# Altium schematic sheet IMU Gesture Recognition Sensors.SchDoc
size A4; SheetNumber: 11; SheetTotal: 17
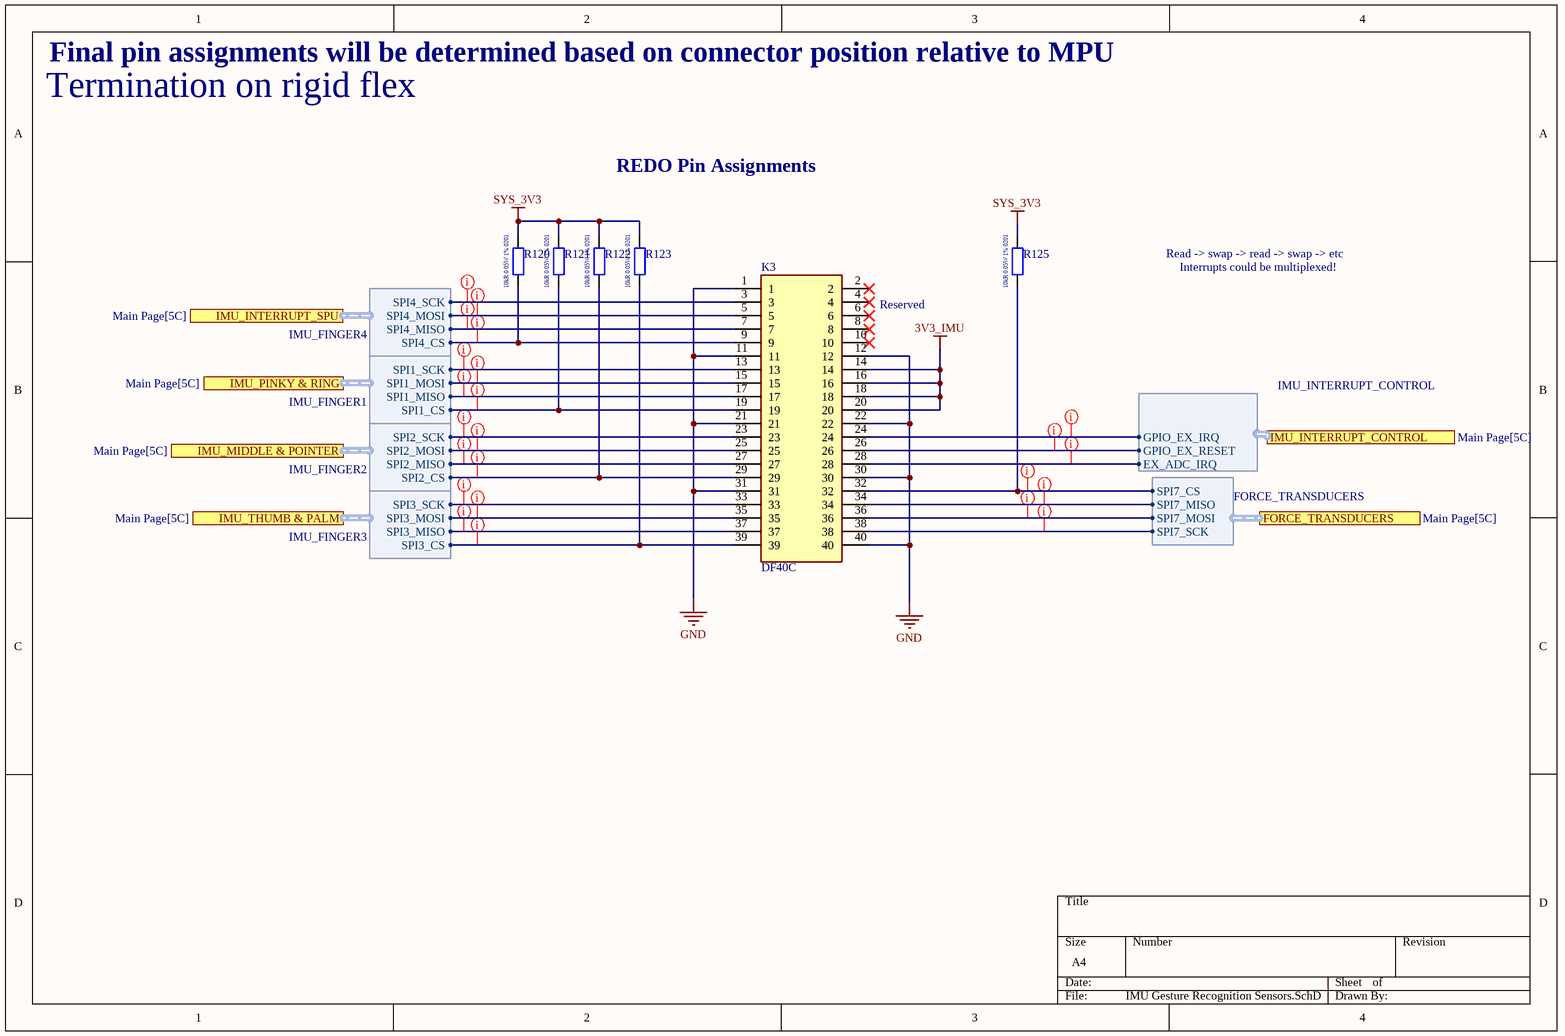
[diagram p0: IMU Gesture Recognition Sensors.SchDoc]

## Parts
K3  DF40C  [HIROSE_DF40C-40DS-0.4V(51)]
R120  ERJ-1GNF1002C  [RESC0603X03L]  (value not drawn)
R121  ERJ-1GNF1002C  [RESC0603X03L]  (value not drawn)
R122  ERJ-1GNF1002C  [RESC0603X03L]  (value not drawn)
R123  ERJ-1GNF1002C  [RESC0603X03L]  (value not drawn)
R125  ERJ-1GNF1002C  [RESC0603X03L]  (value not drawn)

## Ports
FORCE_TRANSDUCERS (harness FORCE_TRANSDUCERS, see Main Page[5C]), IMU_INTERRUPT_CONTROL (harness IMU_INTERRUPT_CONTROL, see Main Page[5C]), IMU_INTERRUPT_SPU (harness IMU_FINGER4, see Main Page[5C]), IMU_MIDDLE & POINTER (harness IMU_FINGER2, see Main Page[5C]), IMU_PINKY & RING (harness IMU_FINGER1, see Main Page[5C]), IMU_THUMB & PALM (harness IMU_FINGER3, see Main Page[5C])

## Harnesses
IMU_FINGER1: SPI1_CS, SPI1_MISO, SPI1_MOSI, SPI1_SCK
IMU_FINGER2: SPI2_CS, SPI2_MISO, SPI2_MOSI, SPI2_SCK
IMU_FINGER3: SPI3_CS, SPI3_MISO, SPI3_MOSI, SPI3_SCK
IMU_FINGER4: SPI4_CS, SPI4_MISO, SPI4_MOSI, SPI4_SCK
FORCE_TRANSDUCERS: SPI7_CS, SPI7_MISO, SPI7_MOSI, SPI7_SCK
IMU_INTERRUPT_CONTROL: GPIO_EX_IRQ, GPIO_EX_RESET, EX_ADC_IRQ

## Nets
3V3_IMU: K3.14 K3.16 K3.18 K3.20
GND: K3.1 K3.11 K3.12 K3.21 K3.22 K3.30 K3.31 K3.40
SYS_3V3: R120.2 R121.2 R122.2 R123.2 R125.2
NetK3_3: K3.3 ; port IMU_INTERRUPT_SPU.SPI4_SCK
NetK3_5: K3.5 ; port IMU_INTERRUPT_SPU.SPI4_MOSI
NetK3_7: K3.7 ; port IMU_INTERRUPT_SPU.SPI4_MISO
NetK3_9: K3.9 R120.1 ; port IMU_INTERRUPT_SPU.SPI4_CS
NetK3_13: K3.13 ; port IMU_PINKY & RING.SPI1_SCK
NetK3_15: K3.15 ; port IMU_PINKY & RING.SPI1_MOSI
NetK3_17: K3.17 ; port IMU_PINKY & RING.SPI1_MISO
NetK3_19: K3.19 R121.1 ; port IMU_PINKY & RING.SPI1_CS
NetK3_23: K3.23 ; port IMU_MIDDLE & POINTER.SPI2_SCK
NetK3_24: K3.24 ; port IMU_INTERRUPT_CONTROL.GPIO_EX_IRQ
NetK3_25: K3.25 ; port IMU_MIDDLE & POINTER.SPI2_MOSI
NetK3_26: K3.26 ; port IMU_INTERRUPT_CONTROL.GPIO_EX_RESET
NetK3_27: K3.27 ; port IMU_MIDDLE & POINTER.SPI2_MISO
NetK3_28: K3.28 ; port IMU_INTERRUPT_CONTROL.EX_ADC_IRQ
NetK3_29: K3.29 R122.1 ; port IMU_MIDDLE & POINTER.SPI2_CS
NetK3_32: K3.32 R125.1 ; port FORCE_TRANSDUCERS.SPI7_CS
NetK3_33: K3.33 ; port IMU_THUMB & PALM.SPI3_SCK
NetK3_34: K3.34 ; port FORCE_TRANSDUCERS.SPI7_MISO
NetK3_35: K3.35 ; port IMU_THUMB & PALM.SPI3_MOSI
NetK3_36: K3.36 ; port FORCE_TRANSDUCERS.SPI7_MOSI
NetK3_37: K3.37 ; port IMU_THUMB & PALM.SPI3_MISO
NetK3_38: K3.38 ; port FORCE_TRANSDUCERS.SPI7_SCK
NetK3_39: K3.39 R123.1 ; port IMU_THUMB & PALM.SPI3_CS

Not connected (* = marked no-connect by the designer): K3 2* 4* 6* 8* 10*

## Layout directives
net class SPI_IMU: NetK3_3, NetK3_5, NetK3_7, NetK3_9, NetK3_13, NetK3_15, NetK3_17, NetK3_19, NetK3_23, NetK3_25, NetK3_27, NetK3_29, NetK3_32, NetK3_33, NetK3_34, NetK3_35, NetK3_36, NetK3_37, NetK3_38, NetK3_39
net class IMU_INTERRUPTS: NetK3_24, NetK3_26, NetK3_28

## Notes on the sheet
- Termination on rigid flex
- Final pin assignments will be determined based on connector position relative to MPU
- REDO Pin Assignments
- (near K3) Reserved
- Read -> swap -> read -> swap -> etc
- Interrupts could be multiplexed!
- (near K3) SPI4
- (near K3) SPI1
- (near K3) SPI2
- (near K3) SPI3
- (in symbol ERJ-1GNF1002C) 10kR 0.05W 1% 0201

## Library data of the parts
K3 = DF40C: 40 Position Connector Receptacle, Center Strip Contacts Surface Mount Gold; Supplier 1: Avnet; Supplier Part Number 1: DF40C-40DS-0.4V(51)
R120-R123 R125 = ERJ-1GNF1002C: 10 kOhms ±1% 0.05W, 1/20W Chip Resistor 0201 (0603 Metric) Thick Film; ComponentLink1Description: New link; ComponentLink1URL: https://www.digikey.com.au/en/products/detail/panasonic-electronic-components/ERJ-1GNF1002C/2036226